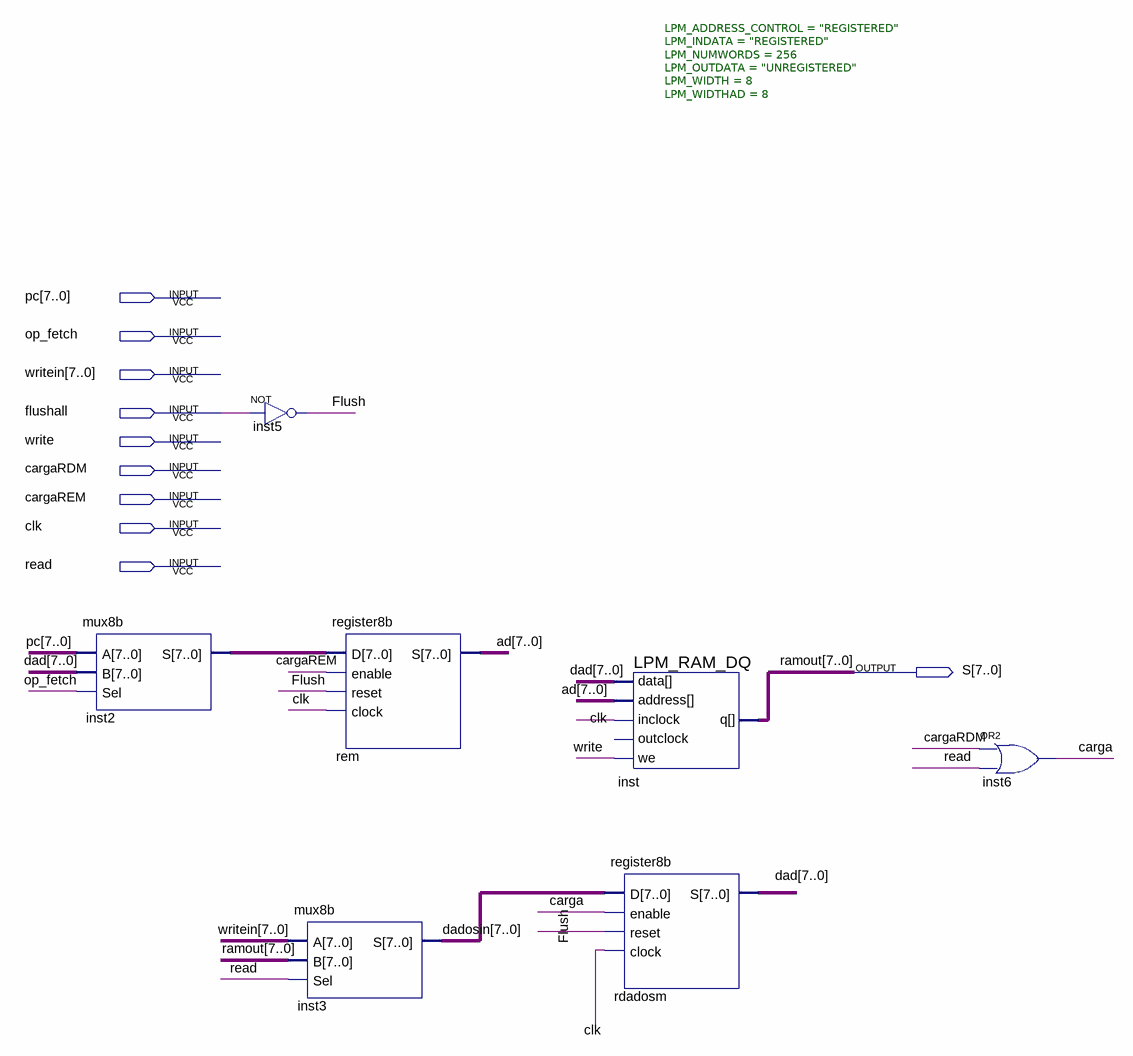
[diagram p0: schematic sheet]
// Quartus schematic mem_unit.bdf as structural Verilog: 7 symbols, 10 pins
module mem_unit (
  input  [7:0] pc,
  input  op_fetch,
  input  [7:0] writein,
  input  flushall,
  input  write,
  input  cargaRDM,
  input  cargaREM,
  input  clk,
  input  read,
  output [7:0] S
);

  wire carga, Flush;
  wire [7:0] ad, dad, dadosin, inst2_s;

  mux8b inst2 (.A(pc), .B(dad), .Sel(op_fetch), .S(inst2_s));
  not inst5 (Flush, flushall);
  register8b rem (.D(inst2_s), .enable(cargaREM), .reset(Flush), .clock(clk), .S(ad));
  mux8b inst3 (.A(writein), .B(S), .Sel(read), .S(dadosin));
  LPM_RAM_DQ #(.LPM_ADDRESS_CONTROL("REGISTERED"), .LPM_INDATA("REGISTERED"), .LPM_NUMWORDS(256), .LPM_OUTDATA("UNREGISTERED"), .LPM_WIDTH(8), .LPM_WIDTHAD(8)) inst (
    .inclock(clk), .data(dad), .address(ad), .we(write), .q(S));  // open: outclock
  register8b rdadosm (.D(dadosin), .enable(carga), .reset(Flush), .clock(clk), .S(dad));
  or inst6 (carga, cargaRDM, read);

  // Other names for the same wires on the sheet: ramout[7:0] = S
endmodule
